# Altium schematic sheet gs358贴片改插件方案.SchDoc
size A3
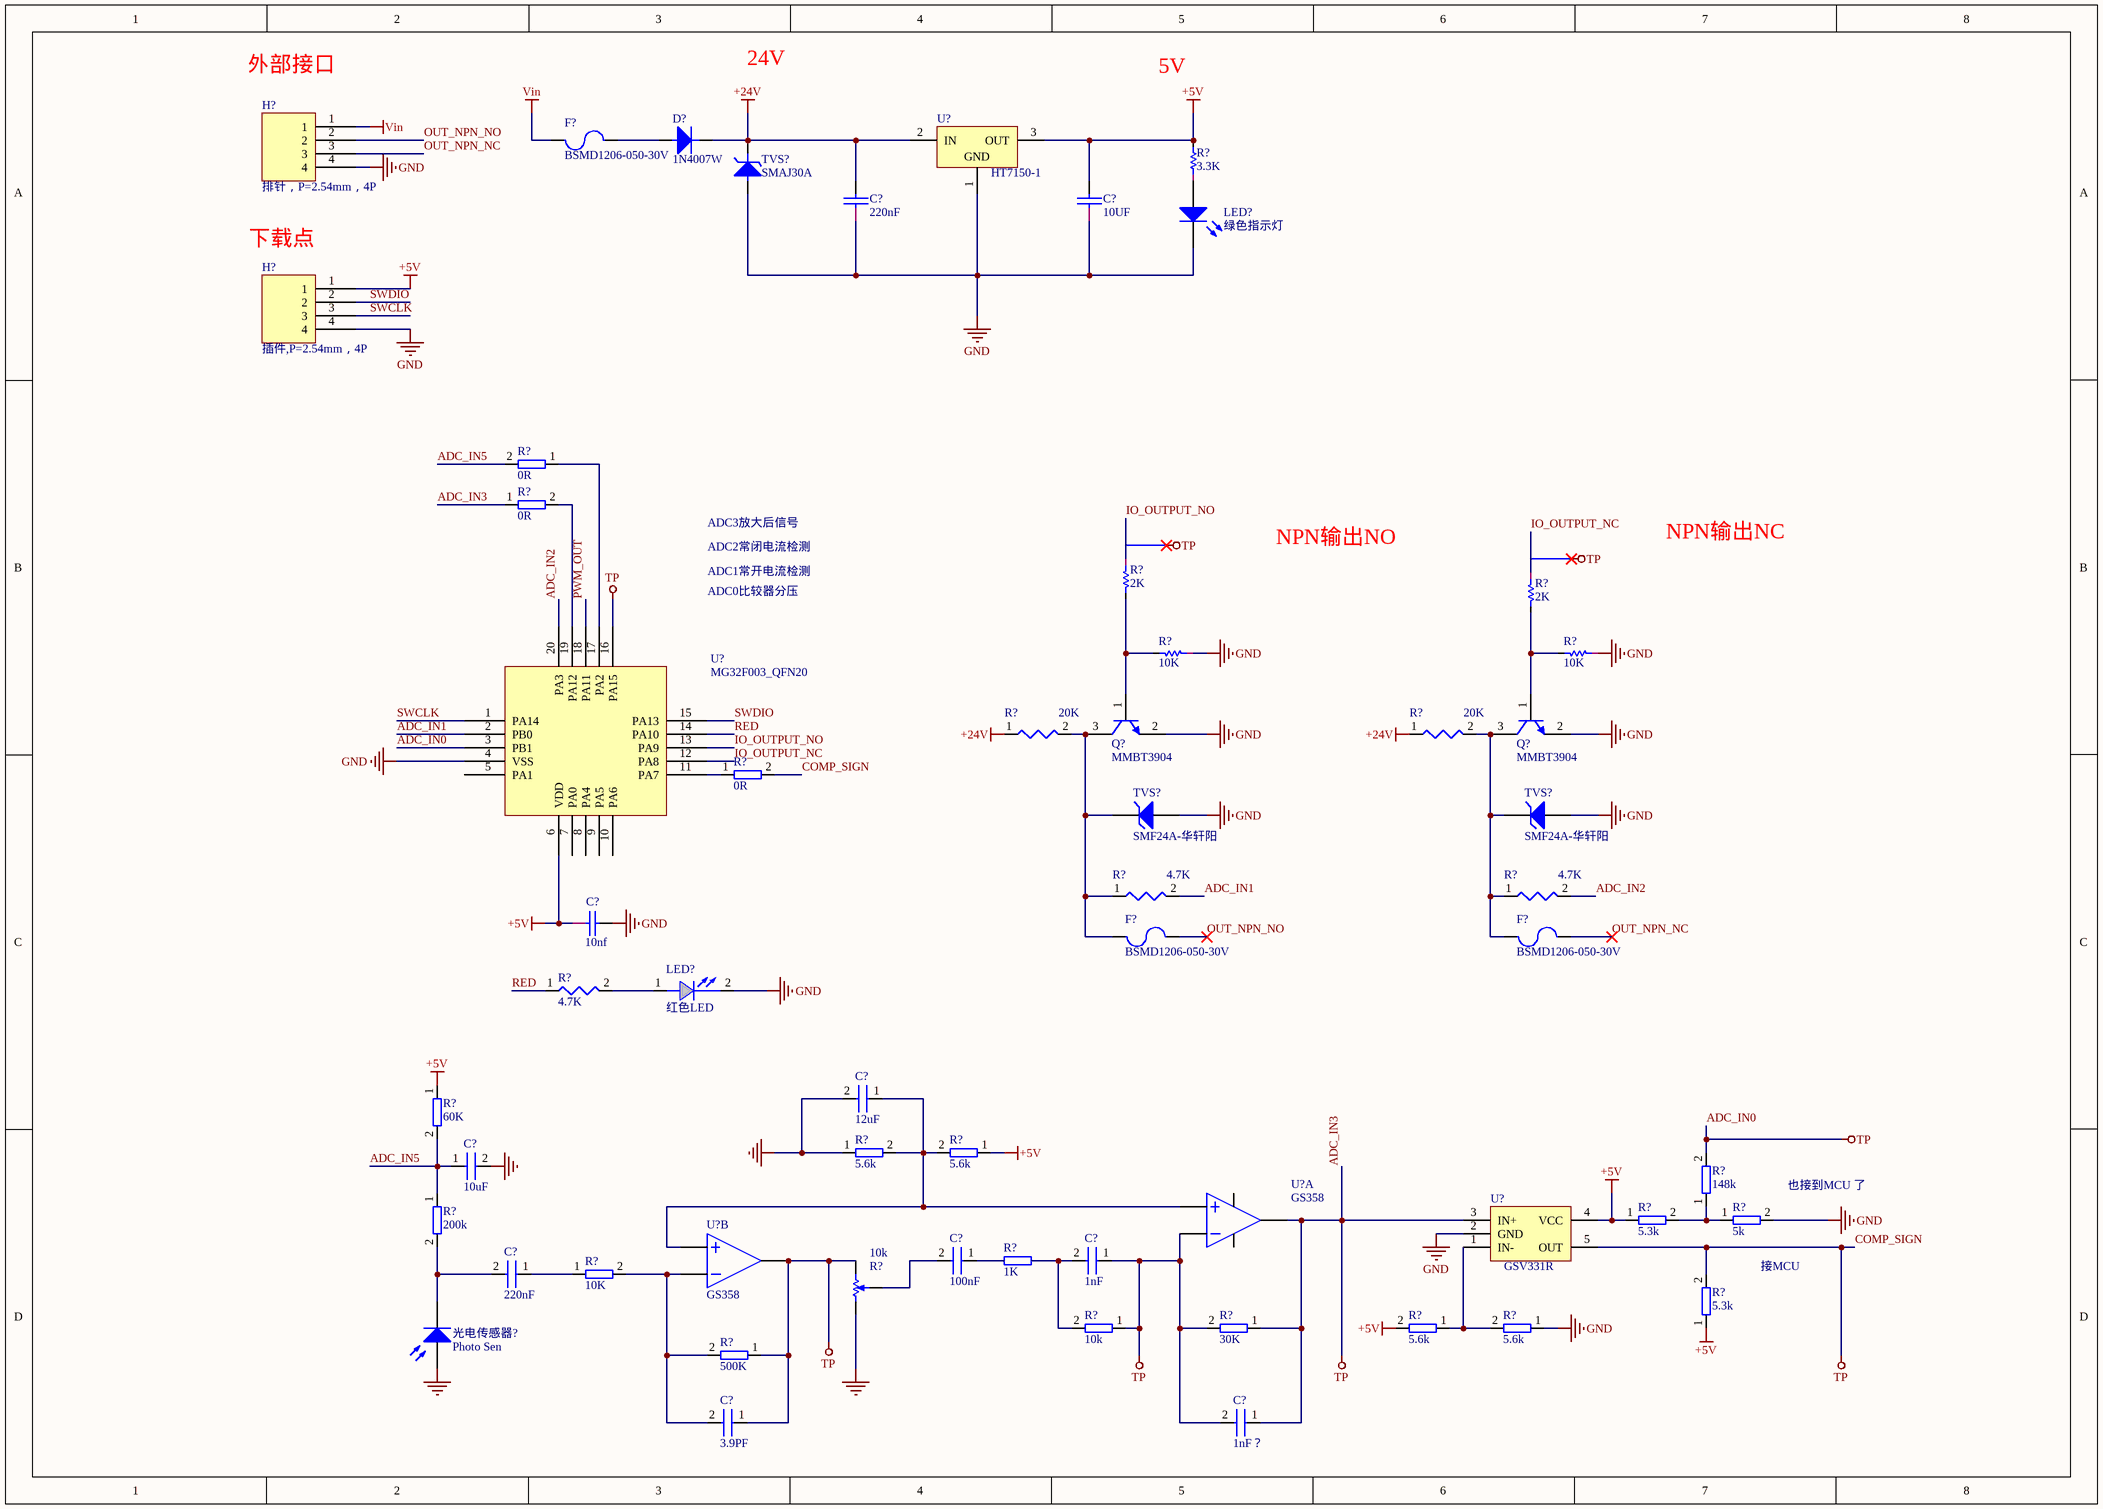
[diagram p0: gs358贴片改插件方案.SchDoc]

## Parts
(Parts that share a designator on the sheet are numbered #1, #2 ... from top to bottom, then left to right.)
C?#1  220nF  [0603A]
C?#2  10UF  [0603A]
C?#3  10nf  [0603A]
C?#4  12uF
C?#5  10uF
C?#6  100nF
C?#7  1nF
C?#8  220nF
C?#9  3.9PF
C?#10  1nF？
D?  1N4007W  [D1]
F?#1  BSMD1206-050-30V  [1206]
F?#2  BSMD1206-050-30V  [1206]
F?#3  BSMD1206-050-30V  [1206]
H?#1  排针，P=2.54mm，4P  [Pin HDR1X4/2.54mm-S]
H?#2  插件,P=2.54mm，4P  [Pin HDR1X4/2.54mm-S]
LED?#1  绿色指示灯  [3.2X1.6X1.1]
LED?#2  红色LED  [0603V]
Q?#1  MMBT3904  [TO-226-AA]
Q?#2  MMBT3904  [TO-226-AA]
R?#1  3.3K  [0603]
R?#2  0R
R?#3  0R
R?#4  2K  [0603]
R?#5  2K  [0603]
R?#6  10K  [0603]
R?#7  10K  [0603]
R?#8  20K  [0402]
R?#9  20K  [0402]
R?#10  0R
R?#11  4.7K  [0402]
R?#12  4.7K  [0402]
R?#13  4.7K  [0402]
R?#14  60K
R?#15  5.6k
R?#16  5.6k
R?#17  200k
R?#18  148k
R?#19  5.3k
R?#20  5k
R?#21  10k  [POT4MM-2]
R?#22  1K
R?#23  10K
R?#24  10k
R?#25  30K
R?#26  5.6k
R?#27  5.6k
R?#28  5.3k
R?#29  500K
TVS?#1  SMAJ30A  [D2]
TVS?#2  SMF24A-华轩阳  [GLZZ0002ZA-A]
TVS?#3  SMF24A-华轩阳  [GLZZ0002ZA-A]
U?#1  HT7150-1  [SOT89N]
U?#2  MG32F003_QFN20  [HT3.96-11P]
U?#3  GS358  [SOP-8]  (part A of 2)
U?#4  GSV331R  [SC70]
U?#5  GS358  [SOP-8]  (part B of 2)
光电传感器?  Photo Sen  [PIN2]

## Nets
+5V: C?#2.1 C?#3.2 H?#2.1 R?#1.1 R?#14.1 R?#16.1 R?#19.1 R?#26.2 R?#28.1 U?#1.3(OUT) U?#2.6(VDD) U?#4.4(VCC)
+24V: C?#1.1 D?.2(K) R?#8.1 R?#9.1 TVS?#1.2 U?#1.2(IN)
ADC_IN0: C?#7.1 C?#9.1 C?#10.1 C?#10.2 R?#3.1 R?#10.2 R?#18.2 R?#21.CW(+) R?#24.1 R?#25.1 R?#25.2 R?#28.2 R?#29.1 U?#2.3(PB1) U?#2.16(PA15) U?#3.1 U?#3.2 U?#4.3(IN+) U?#4.5(OUT) U?#5.7  [also labelled ADC_IN3, COMP_SIGN, TP]
GND: C?#1.2 C?#2.2 C?#3.1 C?#4.2 C?#5.2 H?#1.4 H?#2.4 LED?#1.2(K) LED?#2.2(CATHODE) Q?#1.2(E) Q?#2.2(E) R?#6.2 R?#7.2 R?#15.1 R?#20.2 R?#21.CCW(-) R?#27.1 TVS?#1.1 TVS?#2.2(A) TVS?#3.2(A) U?#1.1(GND) U?#2.4(VSS) U?#4.2(GND) 光电传感器?.1(A)
Vin: F?#1.2 H?#1.1
ADC_IN1: R?#11.2 U?#2.2(PB0)
ADC_IN2: R?#12.2 U?#2.20(PA3)
ADC_IN5: C?#5.1 R?#2.2 R?#14.2 R?#17.1
IO_OUTPUT_NC: R?#5.2 U?#2.12(PA8)
IO_OUTPUT_NO: R?#4.2 U?#2.13(PA9)
OUT_NPN_NC: F?#3.2 H?#1.3
OUT_NPN_NO: F?#2.2 H?#1.2
PWM_OUT: U?#2.18(PA11)
RED: R?#13.1 U?#2.14(PA10)
SWCLK: H?#2.3 U?#2.1(PA14)
SWDIO: H?#2.2 U?#2.15(PA13)
NetC?#4_1: C?#4.1 R?#15.2 R?#16.2 U?#3.3 U?#5.5
NetC?#6_2: C?#6.2 R?#21.W
NetC?#7_2: C?#7.2 R?#24.2
NetC?#8_1: C?#8.1 R?#23.1
NetC?#8_2: C?#8.2 R?#17.2 光电传感器?.2(K)
NetC?#9_2: C?#9.2 R?#23.2 R?#29.2 U?#5.6
NetD?_1: D?.1(A) F?#1.1
NetF?#2_1: F?#2.1 Q?#1.3(C) R?#8.2 R?#11.1 TVS?#2.1(K)
NetF?#3_1: F?#3.1 Q?#2.3(C) R?#9.2 R?#12.1 TVS?#3.1(K)
NetLED?#1_1: LED?#1.1(A) R?#1.2
NetLED?#2_1: LED?#2.1(ANODE) R?#13.2
NetQ?#1_1: Q?#1.1(B) R?#4.1 R?#6.1
NetQ?#2_1: Q?#2.1(B) R?#5.1 R?#7.1
NetR?#2_1: R?#2.1 U?#2.17(PA2)
NetR?#3_2: R?#3.2 U?#2.19(PA12)
NetR?#10_1: R?#10.1 U?#2.11(PA7)
NetR?#18_1: R?#18.1 R?#19.2 R?#20.1
NetR?#26_1: R?#26.1 R?#27.2 U?#4.1(IN-)

Not connected (* = marked no-connect by the designer): C?#6 1; R?#22 1 2; U?#2 5(PA1) 7(PA0) 8(PA4) 9(PA5) 10(PA6); U?#3 4 8

## Notes on the sheet
- 外部接口
- 24V
- 5V
- (near H?#2) 下载点
- ADC1常开电流检测
- ADC2常闭电流检测
- ADC3放大后信号
- NPN输出NO
- NPN输出NC
- ADC0比较器分压
- (near R?#20) 也接到MCU 了
- (near R?#20) 接MCU
- Labels drawn without touching a wire or pin: TP

## Library data of the parts
C?#1 C?#2 = CAP: Capacitor
C?#3 = CAP: 陶瓷电容
C?#4-C?#10 = CAP
D? = DIODE
F?#1-F?#3 = FUSE
H?#1 H?#2 = 4P接线端2mm间距
LED?#1 = LED2: Typical RED, GREEN, YELLOW, AMBER GaAs LED; Published: 8-Jun-2000; LatestRevisionDate: 17-Jul-2002; LatestRevisionNote: Re-released for DXP Platform.; PackageVersion: Feb-2002; PackageReference: 3.2X1.6X1.1; Publisher: Altium Limited; PackageDescription: SM LED; 2 Flat Leads
LED?#2 = LED: Text Field1: 40; Text Field2: 20
Q?#1 Q?#2 = NPN: NPN Bipolar Transistor; Published: 8-Jun-2000; LatestRevisionDate: 17-Jul-2002; LatestRevisionNote: Re-released for DXP Platform.; PackageReference: TO-226-AA; Publisher: Altium Limited; PackageDescription: TO, Flat Index; 3 In-Line, Axial Leads; Body Dia. 4.8mm; Leads 0.55 x 0.51 mm (max); Code_JEDEC: TO-226-AA
R?#1 R?#4-R?#7 = RAS
R?#2 R?#3 R?#10 R?#14-R?#20 R?#22-R?#29 = RES
R?#8 R?#9 R?#11-R?#13 = R: Text Field1: 20; Text Field2: 30
R?#21 = RPot SM: Square Trimming Potentiometer; Published: 17-Dec-2003; DatasheetVersion: Oct-2003; PackageReference: POT4MM-2; Publisher: Altium Limited; PackageDescription: Square Trimming Potentiometer; ComponentLink1Description: Manufacturer Link; ComponentLink1URL: http://bourns.com/2/search.html
TVS?#1 = DIODE V: Varactor Diode
TVS?#2 TVS?#3 = HZK20: Silicon Epitaxial Planar Zener Diodes for Stabilized Power Supply; Published: 12-Feb-2010; DatasheetVersion: Rev.3.00, May-2003; PackageVersion: Aug-2005; PackageReference: GLZZ0002ZA-A; Publisher: Altium Limited; PackageDescription: Metal Electrode Face (MELF) Diode; Body 3.5 x 1.35 mm (LxDia); ComponentLink1Description: Manufacturer Link; ComponentLink1URL: http://sg.renesas.com/fmwk.jsp?cnt=diode_landing.jsp&fp=/products/discrete/diodes/; ComponentLink2Description: Datasheet; ComponentLink2URL: http://documentation.renesas.com/eng/products/diode/rej03g0018_hzk.pdf; ComponentLink3Description: Packaging Specification; ComponentLink3URL: http://sg.renesas.com/media/products/common_info/package/pdf/diode/code/glzz0002za_a.pdf
U?#1 = HT7530-1: 3.0V 100mA Low Power,  Low Dropout Voltage (LDO) Regulator; Published: 30-Mar-2007; DatasheetVersion: rev1.50, Jan-2006; PackageVersion: Jan-2006; PackageReference: SOT-89; Publisher: Altium Limited; PackageDescription: 3-Pin SOT-89 Package 1.5 mm Pitch, 4.1 mm Lead Span; Code_IPC: SOT89; ComponentLink1Description: Manufacturer Link; ComponentLink1URL: http://www.holtek.com/; ComponentLink2Description: Datasheet; ComponentLink2URL: http://www.holtek.com/pdf/consumer/75xx_1v150.pdf
U?#2 = MG32F003-QFN20: QFN20主控芯片
U?#3 U?#5 = LM358
U?#4 = C65
光电传感器? = Photo Sen: Photosensitive Diode; Published: 24-Mar-1999; LatestRevisionDate: 17-Jul-2002; LatestRevisionNote: Re-released for DXP Platform.; PackageReference: PIN2; Publisher: Altium Limited